# Altium schematic sheet I2C_Switch.SchDoc
size A3; Organization: Altium Limited; Address1: L3, 12a Rodborough Rd; Address2: Frenchs Forest; Address3: NSW; Address4: Australia 2086
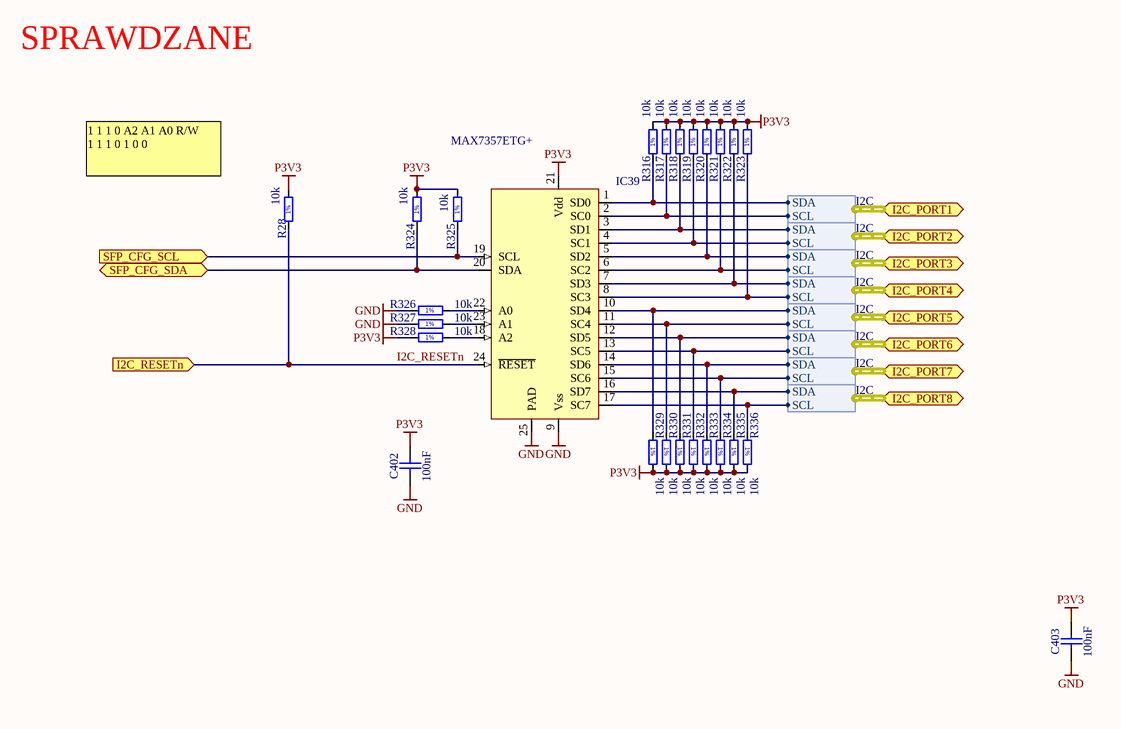
[diagram p0: I2C_Switch.SchDoc]

## Parts
C402  100nF  [CAPC0603X33N]
C403  100nF  [CAPC0603X33N]
IC39  MAX7357ETG+  [HVQFN24]
R28  10k  [RESC1005X40N]
R316  10k  [RESC1005X40N]
R317  10k  [RESC1005X40N]
R318  10k  [RESC1005X40N]
R319  10k  [RESC1005X40N]
R320  10k  [RESC1005X40N]
R321  10k  [RESC1005X40N]
R322  10k  [RESC1005X40N]
R323  10k  [RESC1005X40N]
R324  10k  [RESC1005X40N]
R325  10k  [RESC1005X40N]
R326  10k  [RESC1005X40N]
R327  10k  [RESC1005X40N]
R328  10k  [RESC1005X40N]
R329  10k  [RESC1005X40N]
R330  10k  [RESC1005X40N]
R331  10k  [RESC1005X40N]
R332  10k  [RESC1005X40N]
R333  10k  [RESC1005X40N]
R334  10k  [RESC1005X40N]
R335  10k  [RESC1005X40N]
R336  10k  [RESC1005X40N]

## Ports
I2C_PORT1 (harness I2C), I2C_PORT2 (harness I2C), I2C_PORT3 (harness I2C), I2C_PORT4 (harness I2C), I2C_PORT5 (harness I2C), I2C_PORT6 (harness I2C), I2C_PORT7 (harness I2C), I2C_PORT8 (harness I2C), I2C_RESETn (in), SFP_CFG_SCL (in), SFP_CFG_SDA (bidir)

## Harnesses
I2C: SCL, SDA

## Nets
GND: C402.1 C403.1 IC39.9(Vss) IC39.25(PAD) R326.1 R327.1
P3V3: C402.2 C403.2 IC39.21(Vdd) R28.2 R316.2 R317.2 R318.2 R319.2 R320.2 R321.2 R322.2 R323.2 R324.2 R325.2 R328.1 R329.2 R330.2 R331.2 R332.2 R333.2 R334.2 R335.2 R336.2
I2C_RESETn: IC39.24(~{RESET}) R28.1 ; port I2C_RESETn
SFP_CFG_SCL: IC39.19(SCL) R325.1 ; port SFP_CFG_SCL
SFP_CFG_SDA: IC39.20(SDA) R324.1 ; port SFP_CFG_SDA
NetIC39_1: IC39.1(SD0) R316.1 ; port I2C_PORT1.SDA
NetIC39_2: IC39.2(SC0) R317.1 ; port I2C_PORT1.SCL
NetIC39_3: IC39.3(SD1) R318.1 ; port I2C_PORT2.SDA
NetIC39_4: IC39.4(SC1) R319.1 ; port I2C_PORT2.SCL
NetIC39_5: IC39.5(SD2) R320.1 ; port I2C_PORT3.SDA
NetIC39_6: IC39.6(SC2) R321.1 ; port I2C_PORT3.SCL
NetIC39_7: IC39.7(SD3) R322.1 ; port I2C_PORT4.SDA
NetIC39_8: IC39.8(SC3) R323.1 ; port I2C_PORT4.SCL
NetIC39_10: IC39.10(SD4) R329.1 ; port I2C_PORT5.SDA
NetIC39_11: IC39.11(SC4) R330.1 ; port I2C_PORT5.SCL
NetIC39_12: IC39.12(SD5) R331.1 ; port I2C_PORT6.SDA
NetIC39_13: IC39.13(SC5) R332.1 ; port I2C_PORT6.SCL
NetIC39_14: IC39.14(SD6) R333.1 ; port I2C_PORT7.SDA
NetIC39_15: IC39.15(SC6) R334.1 ; port I2C_PORT7.SCL
NetIC39_16: IC39.16(SD7) R335.1 ; port I2C_PORT8.SDA
NetIC39_17: IC39.17(SC7) R336.1 ; port I2C_PORT8.SCL
NetIC39_18: IC39.18(A2) R328.2
NetIC39_22: IC39.22(A0) R326.2
NetIC39_23: IC39.23(A1) R327.2

## Notes on the sheet
- SPRAWDZANE
- 1 1 1 0 A2 A1 A0 R/W
  1 1 1 0 1 0 0
- (in symbol R0402_10K_1%_0.0625W_100PPM) 1%

## Library data of the parts
C402 C403 = CC0201_100NF_6.3V_10%_X5R: Non-polarised capacitor; Part Description: SMD Multilayer Chip Ceramic Capacitor; Manufacturer: GENERIC; Manufacturer1 Part Number: 02016D104KAT2A; Voltage: 6.3V; TC: X5R; Tolerance: ±10%; Table: Capacitors SMD; Part Number: CC0201_100NF_6.3V_10%_X5R; Component Kind: Standard; Component Type: Standard; Pin Count: 2; Value: 100nF; Status: Not Recommended; Manufacturer Part Number: CC0201_100NF_6.3V_10%_X5R; Case: 0201; Mounted: Yes; Socket: No; SMD: Yes; Manufacturer1 Example: AVX; Manufacturer1 ComponentHeight: 0.33mm; HelpURL: \\cern.ch\dfs\Applications\Altium\Datasheets\CC0201_X5R_AVX.pdf; Author: CERN DEM JLC; CreateDate: 2007-12-03; LatestRevisionDate: 2007-12-03
IC39 = IIC_MUX_MAX7357ETG+: 8-channel I2C-bus multiplexer with reset, INT and timeout
R28 R316-R336 = R0402_10K_1%_0.0625W_100PPM: Resistor - 1%; Part Description: General Purpose Thick Film Chip Resistor; Manufacturer: GENERIC; Manufacturer1 Part Number: 232270671003L; TC: ±100ppm/°C; Table: Resistors SMD; Part Number: R0402_10K_1%_0.0625W_100PPM; Component Kind: Standard; Component Type: Standard; Pin Count: 2; Value: 10k; Status: Not recommended; Power: 0.0625W; Tolerance: ±1%; Manufacturer Part Number: R0402_10K_1%_0.0625W_100PPM; Case: 0402; Mounted: Yes; Socket: No; SMD: Yes; Manufacturer1 Example: YAGEO PHYCOMP; Manufacturer1 ComponentHeight: 0.4mm; HelpURL: \\cern.ch\dfs\Applications\Altium\Datasheets\R0402_Phycomp_RC0402.pdf; Author: CERN DEM JLC; CreateDate: 2007-12-03; LatestRevisionDate: 2012-10-17